# Altium schematic sheet Sensor.SchDoc
size A; SheetNumber: 3; SheetTotal: 4
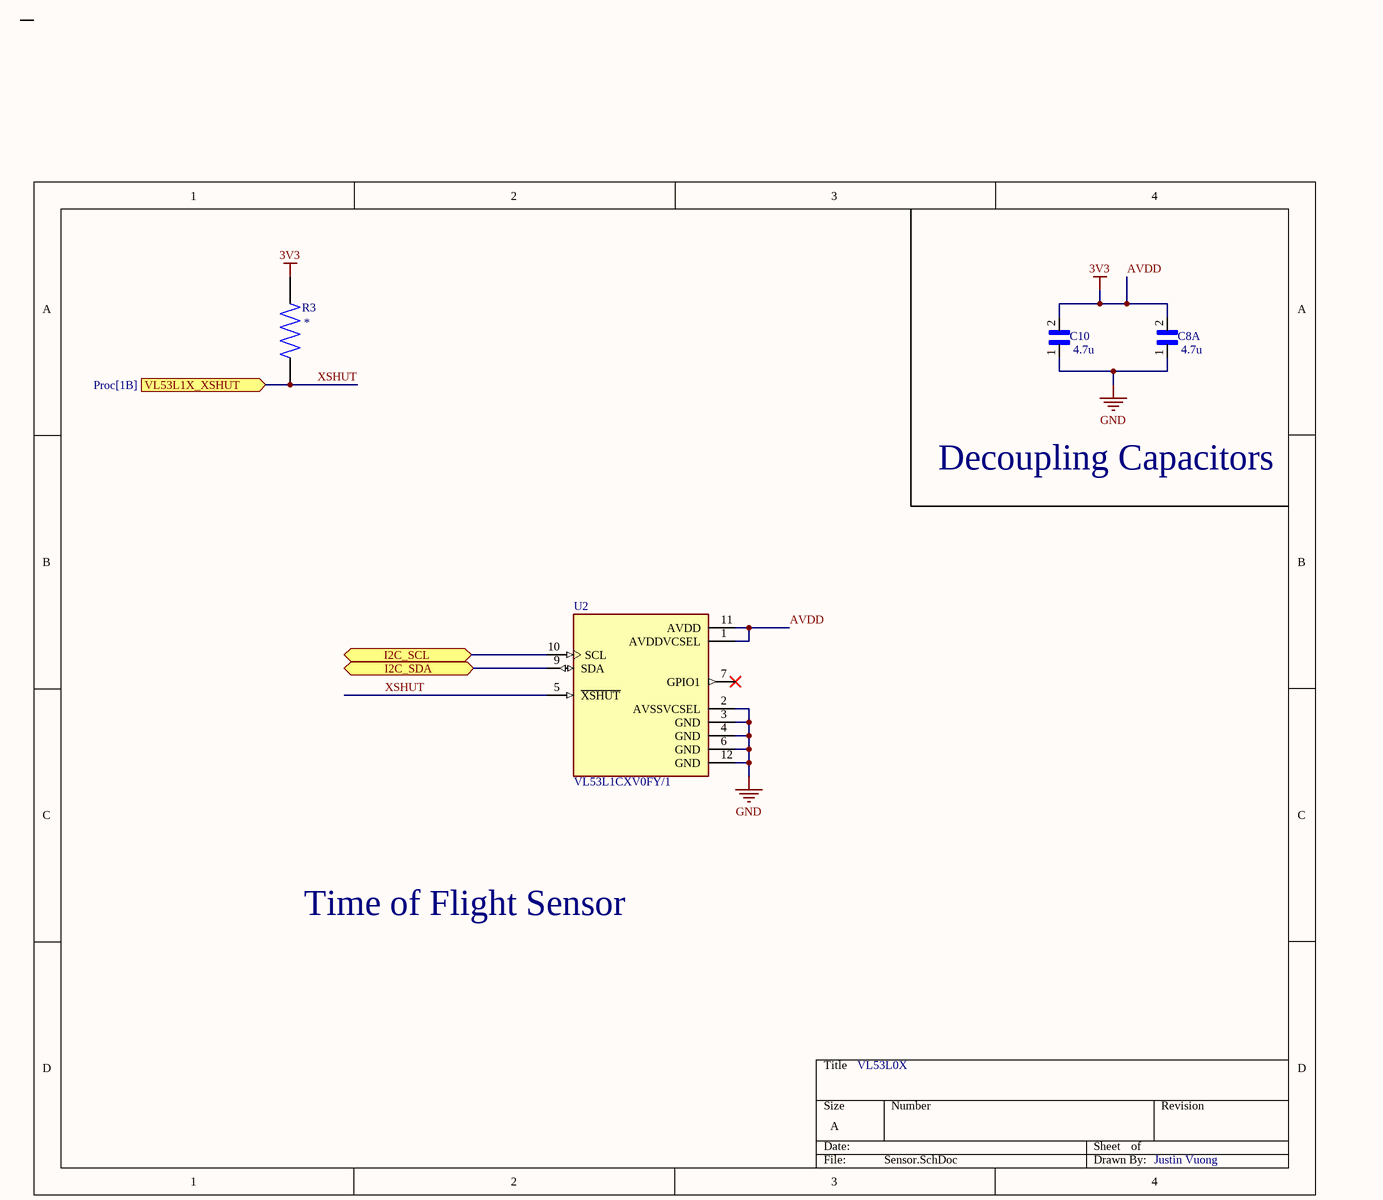
[diagram p0: Sensor.SchDoc]

## Parts
C8  value 4.7u  [CAPC0603X33N]  (hidden comment: CL10A475KQ8NNNC)  (part A of 2)
C10  value 4.7u  [CAPC1005X56N]  (hidden comment: CL05B104KA5NNNC)
R3  AC0402FR-0710KL  [RESC1005X37N]  (value not drawn)
U2  VL53L1CXV0FY/1  [SENSOR_VL53L1CXV0FY/1]

## Ports
I2C_SCL (bidir, see Proc[1C]), I2C_SDA (bidir, see Proc[1C]), VL53L1X_XSHUT (in, see Proc[1B])

## Nets
AVDD: C8.2 C10.2 R3.2 U2.1(AVDDVCSEL) U2.11(AVDD)  [also labelled 3V3]
GND: C8.1 C10.1 U2.2(AVSSVCSEL) U2.3(GND) U2.4(GND) U2.6(GND) U2.12(GND)
I2C_SCL: U2.10(SCL) ; port I2C_SCL
I2C_SDA: U2.9(SDA) ; port I2C_SDA
XSHUT: R3.1 U2.5(~{XSHUT}) ; port VL53L1X_XSHUT

Not connected (* = marked no-connect by the designer): U2 7(GPIO1)*

## Notes on the sheet
- Decoupling Capacitors
- Time of Flight Sensor
- VL53L0X
- Justin Vuong

## Library data of the parts
C8 = GRM0335C1H1R6BA01D: 4.7 µF ±10% 6.3V Ceramic Capacitor X5R 0603 (1608 Metric); MF: Murata; Price: None; SnapEDA_Link: https://www.snapeda.com/parts/GRM0335C1H1R6BA01D/Murata/view-part/1800095/?ref=snap; Purchase-URL: https://pricing.snapeda.com/search/part/GRM0335C1H1R6BA01D/?ref=eda; Check_prices: https://www.snapeda.com/parts/GRM0335C1H1R6BA01D/Murata/view-part/1800095/?ref=eda; MP: GRM0335C1H1R6BA01D; Package: 0603 Taiyo Yuden; Availability: Warning
C10 = 04025A8R2CAT2A: 4.7 µF ±10% 6.3V Ceramic Capacitor X5R 0603 (1608 Metric); MF: AVX; Digi-Key_Purchase_URL: https://www.digikey.tn/product-detail/en/avx-corporation/04025A8R2CAT2A/478-1069-1-ND/564101?utm_source=snapeda&utm_medium=aggregator&utm_campaign=symbol; Digi-Key_Part_Number: 478-1069-1-ND; Package: 1005 AVX; MP: 04025A8R2CAT2A; SnapEDA_Link: https://www.snapeda.com/parts/04025A8R2CAT2A/AVX/view-part/449449/?ref=snap
R3 = AC0402FR-0710KL: 10 kOhms Â±1% 0.063W, 1/16W Chip Resistor 0402 (1005 Metric) Automotive AEC-Q200, Moisture Resistant Thick Film; MF: Yageo; MP: AC0402FR-0710KL; Package: 1005 Yageo; Purchase-URL: https://pricing.snapeda.com/search/part/AC0402FR-0710KL/?ref=eda; Check_prices: https://www.snapeda.com/parts/AC0402FR-0710KL/Yageo/view-part/?ref=eda; Value: *; Digi-Key_Part_Number: YAG3436TR-ND; SnapEDA_Link: https://www.snapeda.com/parts/AC0402FR-0710KL/Yageo/view-part/?ref=snap
U2 = VL53L1CXV0FY/1: Optical Sensor 157.480 (4m) IÂ²C Output; MF: STMicroelectronics; SnapEDA_Link: https://www.snapeda.com/parts/VL53L1CXV0FY/1/STMicroelectronics/view-part/?ref=snap; Package: LGA-12 STMicroelectronics; MP: VL53L1CXV0FY/1; Check_prices: https://www.snapeda.com/parts/VL53L1CXV0FY/1/STMicroelectronics/view-part/?ref=eda; Purchase-URL: https://pricing.snapeda.com/search/part/VL53L1CXV0FY/1/?ref=eda; Price: None; Value: *; Availability: In Stock